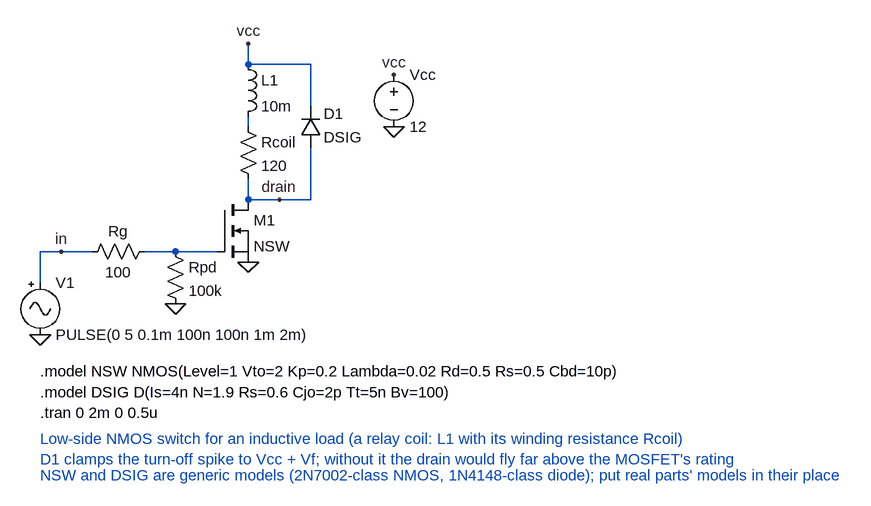
[diagram p0: schematic nmos_lowside_switch.asc]
nmos_lowside_switch.asc, the LTspice schematic file:
Version 4
SHEET 1 880 680
WIRE 352 32 352 64
WIRE 448 64 352 64
WIRE 448 128 448 64
WIRE 352 160 352 144
WIRE 352 272 352 240
WIRE 448 272 448 192
WIRE 448 272 352 272
WIRE 32 352 32 400
WIRE 112 352 32 352
WIRE 240 352 192 352
WIRE 304 352 240 352
FLAG 352 32 vcc
FLAG 400 272 drain
FLAG 352 368 0
FLAG 32 480 0
FLAG 240 432 0
FLAG 64 352 in
FLAG 576 80 vcc
FLAG 576 160 0
SYMBOL ind 336 48 R0
SYMATTR InstName L1
SYMATTR Value 10m
SYMBOL res 336 144 R0
SYMATTR InstName Rcoil
SYMATTR Value 120
SYMBOL diode 432 192 M180
WINDOW 0 36 52 Left 2
WINDOW 3 36 16 Left 2
SYMATTR InstName D1
SYMATTR Value DSIG
SYMBOL nmos 304 272 R0
SYMATTR InstName M1
SYMATTR Value NSW
SYMBOL Misc\signal 32 384 R0
SYMATTR InstName V1
SYMATTR Value PULSE(0 5 0.1m 100n 100n 1m 2m)
SYMBOL res 208 336 R90
WINDOW 0 0 56 VBottom 2
WINDOW 3 32 56 VTop 2
SYMATTR InstName Rg
SYMATTR Value 100
SYMBOL res 224 336 R0
SYMATTR InstName Rpd
SYMATTR Value 100k
SYMBOL voltage 576 64 R0
SYMATTR InstName Vcc
SYMATTR Value 12
TEXT 32 536 Left 2 !.model NSW NMOS(Level=1 Vto=2 Kp=0.2 Lambda=0.02 Rd=0.5 Rs=0.5 Cbd=10p)
TEXT 32 568 Left 2 !.model DSIG D(Is=4n N=1.9 Rs=0.6 Cjo=2p Tt=5n Bv=100)
TEXT 32 600 Left 2 !.tran 0 2m 0 0.5u
TEXT 32 640 Left 2 ;Low-side NMOS switch for an inductive load (a relay coil: L1 with its winding resistance Rcoil)\nD1 clamps the turn-off spike to Vcc + Vf; without it the drain would fly far above the MOSFET's rating
TEXT 32 696 Left 2 ;NSW and DSIG are generic models (2N7002-class NMOS, 1N4148-class diode); put real parts' models in their place

The netlist it stands for:
* nmos_lowside_switch.asc
L1 vcc N001 10m
Rcoil N001 drain 120
D1 drain vcc DSIG
M1 drain N002 0 0 NSW
V1 in 0 PULSE(0 5 0.1m 100n 100n 1m 2m)
Rg N002 in 100
Rpd N002 0 100k
Vcc vcc 0 12
.model D D
.lib standard.dio
.model NMOS NMOS
.model PMOS PMOS
.lib standard.mos
.model NSW NMOS(Level=1 Vto=2 Kp=0.2 Lambda=0.02 Rd=0.5 Rs=0.5 Cbd=10p)
.model DSIG D(Is=4n N=1.9 Rs=0.6 Cjo=2p Tt=5n Bv=100)
.tran 0 2m 0 0.5u
* Low-side NMOS switch for an inductive load (a relay coil: L1 with its winding resistance Rcoil)
* D1 clamps the turn-off spike to Vcc + Vf; without it the drain would fly far above the MOSFET's rating
* NSW and DSIG are generic models (2N7002-class NMOS, 1N4148-class diode); put real parts' models in their place
.backanno
.end